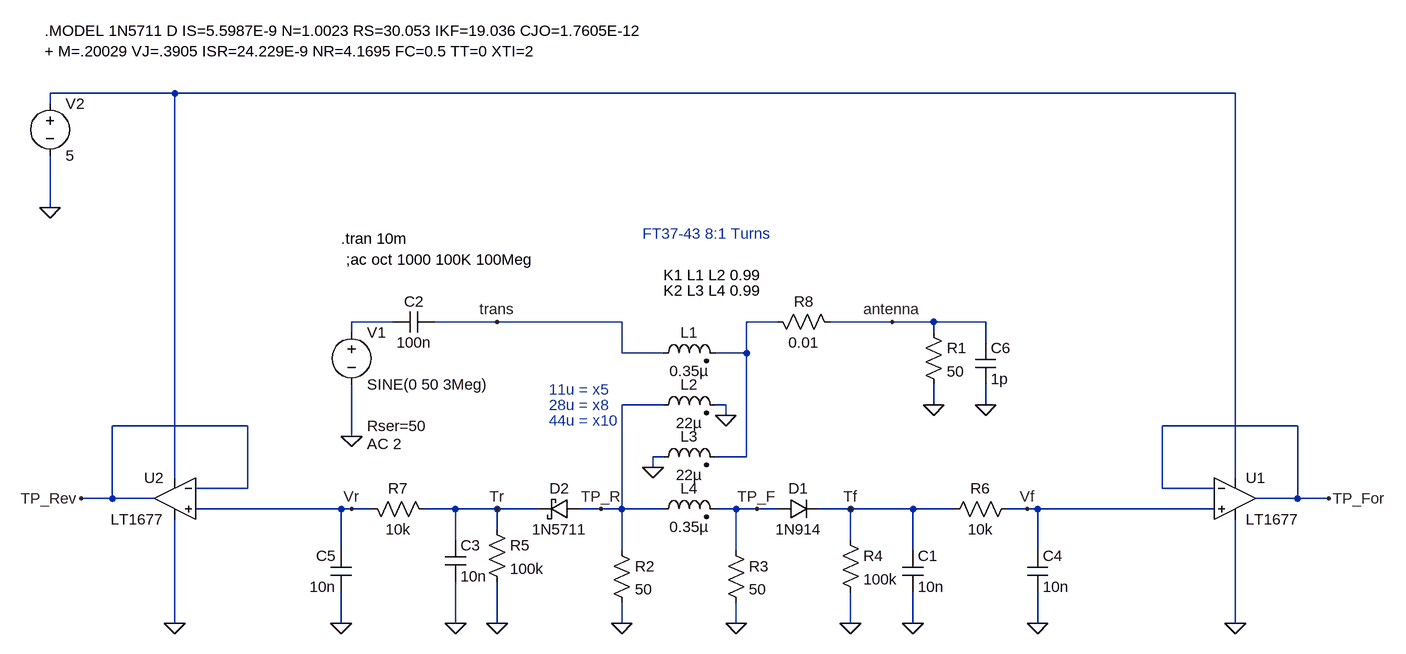
[diagram p0: schematic 4020 SWR 1.asc]
4020 SWR 1.asc, the LTspice schematic file:
Version 4
SHEET 1 3812 1732
WIRE -1552 -464 -1744 -464
WIRE 80 -464 -1552 -464
WIRE -1744 -448 -1744 -464
WIRE -1744 -288 -1744 -368
WIRE -1216 -112 -1280 -112
WIRE -1056 -112 -1152 -112
WIRE -864 -112 -1056 -112
WIRE -624 -112 -672 -112
WIRE -448 -112 -544 -112
WIRE -384 -112 -448 -112
WIRE -304 -112 -384 -112
WIRE -1280 -96 -1280 -112
WIRE -384 -96 -384 -112
WIRE -304 -80 -304 -112
WIRE -864 -64 -864 -112
WIRE -800 -64 -864 -64
WIRE -672 -64 -672 -112
WIRE -672 -64 -720 -64
WIRE -800 16 -864 16
WIRE -704 16 -720 16
WIRE -384 16 -384 -16
WIRE -304 16 -304 -16
WIRE -704 32 -704 16
WIRE -1440 48 -1648 48
WIRE 176 48 -32 48
WIRE -1280 64 -1280 -16
WIRE -800 96 -816 96
WIRE -672 96 -672 -64
WIRE -672 96 -720 96
WIRE -816 112 -816 96
WIRE -1552 128 -1552 -464
WIRE 80 128 80 -464
WIRE -1440 144 -1440 48
WIRE -1440 144 -1520 144
WIRE -32 144 -32 48
WIRE 48 144 -32 144
WIRE -1648 160 -1648 48
WIRE -1648 160 -1696 160
WIRE -1584 160 -1648 160
WIRE 176 160 176 48
WIRE 176 160 112 160
WIRE 224 160 176 160
WIRE -1296 176 -1520 176
WIRE -1280 176 -1296 176
WIRE -1248 176 -1280 176
WIRE -1120 176 -1168 176
WIRE -1056 176 -1120 176
WIRE -992 176 -1056 176
WIRE -896 176 -928 176
WIRE -864 176 -864 16
WIRE -864 176 -896 176
WIRE -800 176 -864 176
WIRE -688 176 -720 176
WIRE -656 176 -688 176
WIRE -624 176 -656 176
WIRE -512 176 -560 176
WIRE -416 176 -512 176
WIRE -352 176 -416 176
WIRE -240 176 -272 176
WIRE -224 176 -240 176
WIRE 48 176 -224 176
WIRE -1056 208 -1056 176
WIRE -1120 224 -1120 176
WIRE -512 224 -512 176
WIRE -1296 240 -1296 176
WIRE -864 240 -864 176
WIRE -688 240 -688 176
WIRE -416 240 -416 176
WIRE -224 240 -224 176
WIRE -1552 352 -1552 192
WIRE -1296 352 -1296 304
WIRE -1120 352 -1120 288
WIRE -1056 352 -1056 288
WIRE -864 352 -864 320
WIRE -688 352 -688 320
WIRE -512 352 -512 304
WIRE -416 352 -416 304
WIRE -224 352 -224 304
WIRE 80 352 80 192
FLAG -1280 64 0
FLAG -448 -112 antenna
FLAG -688 352 0
FLAG -384 16 0
FLAG -1056 -112 trans
FLAG -704 32 0
FLAG -816 112 0
FLAG -864 352 0
FLAG -1120 352 0
FLAG -1056 352 0
FLAG -512 352 0
FLAG -416 352 0
FLAG -240 176 Vf
FLAG -1280 176 Vr
FLAG -224 352 0
FLAG -1296 352 0
FLAG -1056 176 Tr
FLAG -512 176 Tf
FLAG -656 176 TP_F
FLAG -896 176 TP_R
FLAG 80 352 0
FLAG -1744 -288 0
FLAG -1552 352 0
FLAG -1696 160 TP_Rev
FLAG 224 160 TP_For
FLAG -304 16 0
SYMBOL voltage -1280 -112 R0
WINDOW 123 24 188 Left 2
WINDOW 39 24 160 Left 2
SYMATTR Value2 AC 2
SYMATTR SpiceLine Rser=50
SYMATTR InstName V1
SYMATTR Value SINE(0 50 3Meg)
SYMBOL cap -1216 -96 R270
WINDOW 0 32 32 VTop 2
WINDOW 3 0 32 VBottom 2
SYMATTR InstName C2
SYMATTR Value 100n
SYMBOL ind2 -816 32 R270
WINDOW 0 32 56 VTop 2
WINDOW 3 4 56 VBottom 2
SYMATTR InstName L2
SYMATTR Value 22µ
SYMATTR Type ind
SYMBOL ind2 -816 -48 R270
WINDOW 0 32 56 VTop 2
WINDOW 3 4 56 VBottom 2
SYMATTR InstName L1
SYMATTR Value 0.35µ
SYMATTR Type ind
SYMBOL ind2 -816 192 R270
WINDOW 0 32 56 VTop 2
WINDOW 3 4 56 VBottom 2
SYMATTR InstName L4
SYMATTR Value 0.35µ
SYMATTR Type ind
SYMBOL ind2 -816 112 R270
WINDOW 0 32 56 VTop 2
WINDOW 3 4 56 VBottom 2
SYMATTR InstName L3
SYMATTR Value 22µ
SYMATTR Type ind
SYMBOL res -400 -112 R0
SYMATTR InstName R1
SYMATTR Value 50
SYMBOL diode -624 192 R270
WINDOW 0 32 32 VTop 2
WINDOW 3 0 32 VBottom 2
SYMATTR InstName D1
SYMATTR Value 1N914
SYMBOL schottky -928 160 R90
WINDOW 0 0 32 VBottom 2
WINDOW 3 32 32 VTop 2
SYMATTR InstName D2
SYMATTR Value 1N5711
SYMATTR Description Diode
SYMATTR Type diode
SYMBOL res -880 224 R0
SYMATTR InstName R2
SYMATTR Value 50
SYMBOL res -704 224 R0
SYMATTR InstName R3
SYMATTR Value 50
SYMBOL res -1072 192 R0
SYMATTR InstName R5
SYMATTR Value 100k
SYMBOL cap -432 240 R0
SYMATTR InstName C1
SYMATTR Value 10n
SYMBOL cap -1136 224 R0
SYMATTR InstName C3
SYMATTR Value 10n
SYMBOL res -256 160 R90
WINDOW 0 0 56 VBottom 2
WINDOW 3 32 56 VTop 2
SYMATTR InstName R6
SYMATTR Value 10k
SYMBOL cap -240 240 R0
SYMATTR InstName C4
SYMATTR Value 10n
SYMBOL res -1264 160 M90
WINDOW 0 0 56 VBottom 2
WINDOW 3 32 56 VTop 2
SYMATTR InstName R7
SYMATTR Value 10k
SYMBOL cap -1280 240 M0
SYMATTR InstName C5
SYMATTR Value 10n
SYMBOL res -640 -128 M90
WINDOW 0 0 56 VBottom 2
WINDOW 3 32 56 VTop 2
SYMATTR InstName R8
SYMATTR Value 0.01
SYMBOL Opamps\\LT1677 80 96 R0
SYMATTR InstName U1
SYMBOL voltage -1744 -464 R0
SYMATTR InstName V2
SYMATTR Value 5
SYMBOL Opamps\\LT1677 -1552 96 M0
SYMATTR InstName U2
SYMBOL cap -320 -80 R0
SYMATTR InstName C6
SYMATTR Value 1p
SYMBOL res -528 208 R0
SYMATTR InstName R4
SYMATTR Value 100k
TEXT -1296 -240 Left 2 !.tran 10m
TEXT -800 -184 Left 2 !K1 L1 L2 0.99
TEXT -1288 -208 Left 2 !;ac oct 1000 100K 100Meg
TEXT -800 -160 Left 2 !K2 L3 L4 0.99
TEXT -1752 -560 Left 2 !.MODEL 1N5711 D IS=5.5987E-9 N=1.0023 RS=30.053 IKF=19.036 CJO=1.7605E-12\n+ M=.20029 VJ=.3905 ISR=24.229E-9 NR=4.1695 FC=0.5 TT=0 XTI=2
TEXT -976 -8 Left 2 ;11u = x5
TEXT -976 16 Left 2 ;28u = x8
TEXT -976 40 Left 2 ;44u = x10
TEXT -832 -248 Left 2 ;FT37-43 8:1 Turns

The netlist it stands for:
* 4020 SWR 1.asc
V1 N002 0 SINE(0 50 3Meg) AC 2 Rser=50
C2 N002 trans 100n
L2 TP_R 0 22µ
L1 trans N003 0.35µ
L4 TP_R TP_F 0.35µ
L3 0 N003 22µ
R1 antenna 0 50
D1 TP_F Tf 1N914
D2 TP_R Tr 1N5711
R2 TP_R 0 50
R3 TP_F 0 50
R5 Tr 0 100k
C1 Tf 0 10n
C3 Tr 0 10n
R6 Vf Tf 10k
C4 Vf 0 10n
R7 Vr Tr 10k
C5 Vr 0 10n
R8 N003 antenna 0.01
XU1 Vf TP_For N001 0 TP_For LT1677  ; pins In+ In- V+ V- OUT
V2 N001 0 5
XU2 Vr TP_Rev N001 0 TP_Rev LT1677  ; pins In+ In- V+ V- OUT
C6 antenna 0 1p
R4 Tf 0 100k
.model D D
.lib standard.dio
.tran 10m
K1 L1 L2 0.99
;ac oct 1000 100K 100Meg
K2 L3 L4 0.99
.MODEL 1N5711 D IS=5.5987E-9 N=1.0023 RS=30.053 IKF=19.036 CJO=1.7605E-12
+ M=.20029 VJ=.3905 ISR=24.229E-9 NR=4.1695 FC=0.5 TT=0 XTI=2
* 11u = x5
* 28u = x8
* 44u = x10
* FT37-43 8:1 Turns
.lib LTC.lib
.backanno
.end